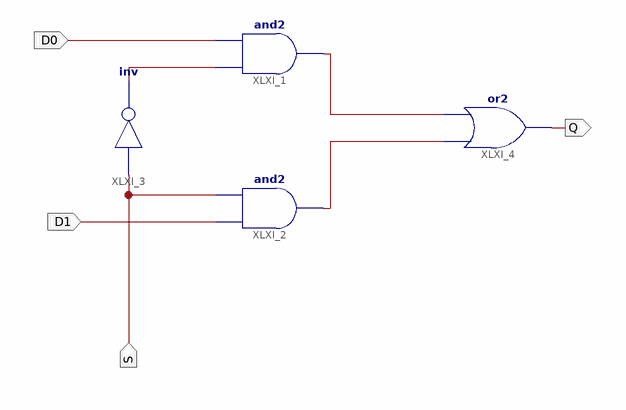
[diagram p0: schematic sheet 1]
// Xilinx ISE schematic Mux_2_1.sch (spartan3e) as structural Verilog: 4 symbols, 4 ports
module Mux_2_1 (
  input  S,
  input  D0,
  input  D1,
  output Q
);

  wire XLXN_1, XLXN_6, XLXN_7;

  and XLXI_1 (XLXN_6, XLXN_1, D0);
  and XLXI_2 (XLXN_7, D1, S);
  not XLXI_3 (XLXN_1, S);
  or XLXI_4 (Q, XLXN_7, XLXN_6);
endmodule
